# Altium schematic sheet KX1_DB_ADC_1.SchDoc
size 260 x 195 mm; PageSetup: Record=PageOptions|CenterHorizontal=True|CenterVertical=True|PrintScale=0.82|XCorrection=1.00|YCorrection=1.00|PrintKind=2|BorderSize=5000000|LeftOffset=0|BottomOffset=0|Orientation=2|PaperLength=1000|PaperWidth=1000|Scale=100|PaperSource=15|PrintQuality=600|MediaType=1|DitherType=10|PaperKind=Letter|PrintScaleMode=1
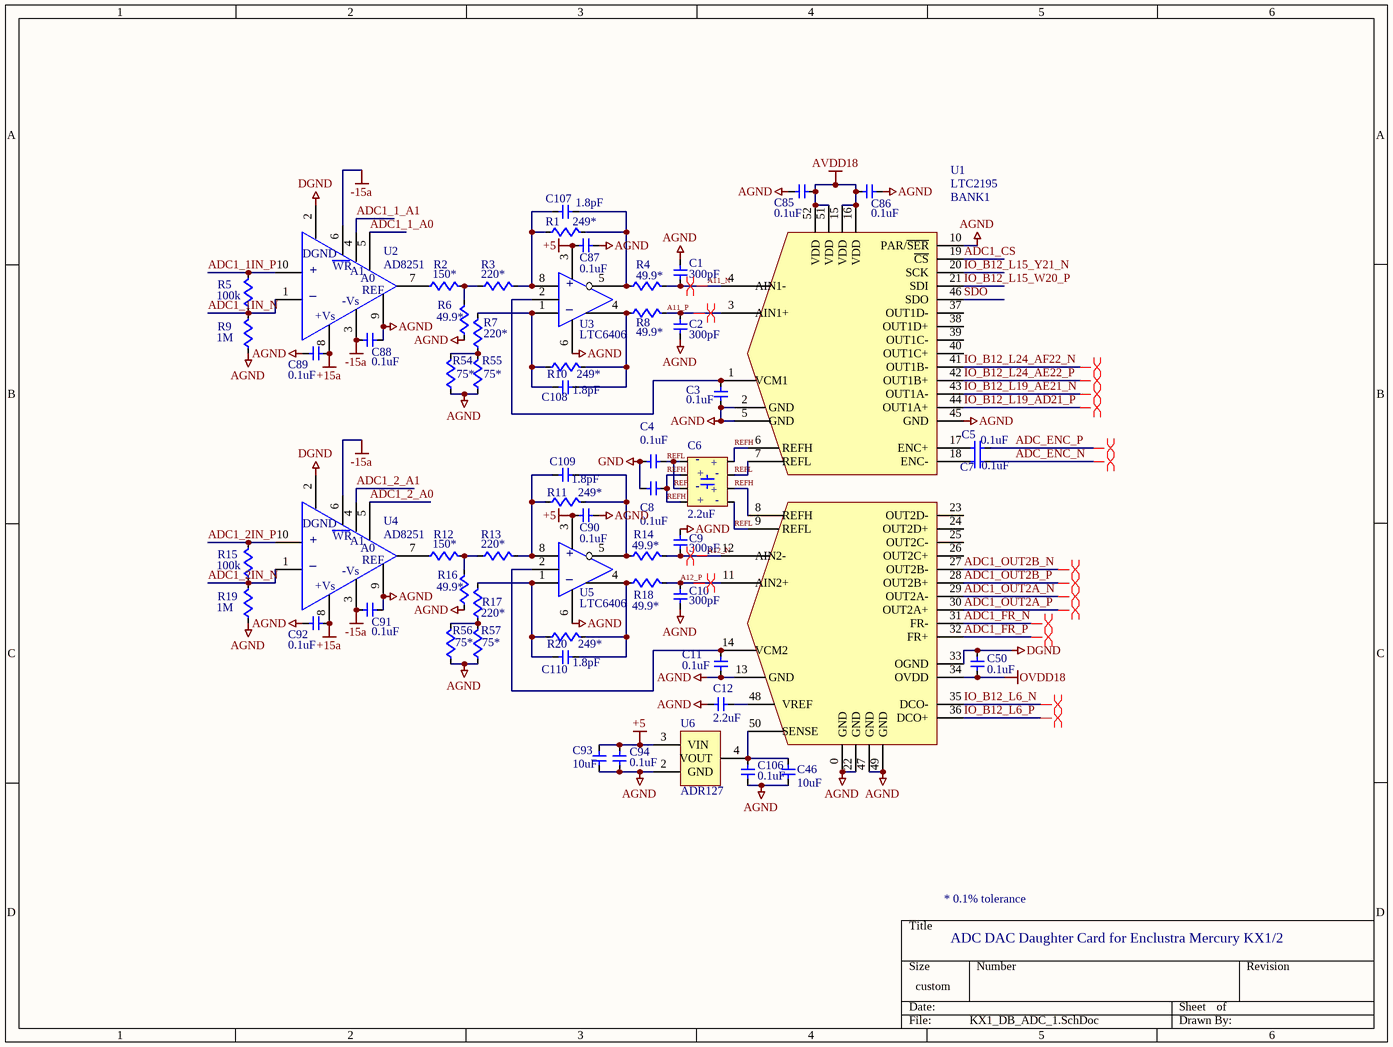
[diagram p0: KX1_DB_ADC_1.SchDoc]

## Parts
C1  300pF  [0603w]
C2  300pF  [0603w]
C3  0.1uF  [0603w]
C4  0.1uF  [0603w]
C5  0.1uF  [1206]
C6  2.2uF  [1206CLL]
C7  0.1uF  [1206]
C8  0.1uF  [0603w]
C9  300pF  [0603w]
C10  300pF  [0603w]
C11  0.1uF  [0603w]
C12  2.2uF  [0603w]
C46  10uF  [0603w]
C50  0.1uF  [0603w]
C85  0.1uF  [0603w]
C86  0.1uF  [0603w]
C87  0.1uF  [0603w]
C88  0.1uF  [0603w]
C89  0.1uF  [0603w]
C90  0.1uF  [0603w]
C91  0.1uF  [0603w]
C92  0.1uF  [0603w]
C93  10uF  [0603w]
C94  0.1uF  [0603w]
C106  0.1uF  [0603w]
C107  1.8pF  [0603w]
C108  1.8pF  [0603w]
C109  1.8pF  [0603w]
C110  1.8pF  [0603w]
R1  249*  [0603w]
R2  150*  [0603w]
R3  220*  [0603w]
R4  49.9*  [0603w]
R5  100k  [0603w]
R6  49.9*  [0603w]
R7  220*  [0603w]
R8  49.9*  [0603w]
R9  1M  [0603w]
R10  249*  [0603w]
R11  249*  [0603w]
R12  150*  [0603w]
R13  220*  [0603w]
R14  49.9*  [0603w]
R15  100k  [0603w]
R16  49.9*  [0603w]
R17  220*  [0603w]
R18  49.9*  [0603w]
R19  1M  [0603w]
R20  249*  [0603w]
R54  75*  [0603w]
R55  75*  [0603w]
R56  75*  [0603w]
R57  75*  [0603w]
U1  LTC2195  [UKG - QFN52]
U2  AD8251  [MSOP10sm]
U3  LTC6406  [MSOP08]
U4  AD8251  [MSOP10sm]
U5  LTC6406  [MSOP08]
U6  ADR127  [TSOT-6]

## Nets
+5: C87.1 C90.1 C93.1 C94.2 U3.3 U5.3 U6.3(VIN)
+15a: C89.1 C92.1 U2.8 U4.8
-15a: C88.1 C91.1 U2.3 U2.6 U4.3 U4.6
AGND: C1.1 C2.2 C3.2 C9.1 C10.2 C11.2 C12.2 C46.2 C85.2 C86.2 C87.2 C88.2 C89.2 C90.2 C91.2 C92.2 C93.2 C94.1 C106.1 R6.1 R9.1 R16.1 R19.1 R54.1 R55.1 R56.1 R57.1 U1.0(GND) U1.2(GND) U1.5(GND) U1.10(PAR/~{SER}) U1.13(GND) U1.22(GND) U1.45(GND) U1.47(GND) U1.49(GND) U2.9 U3.6 U4.9 U5.6 U6.2(GND)
AVDD18: C85.1 C86.1 U1.15(VDD) U1.16(VDD) U1.51(VDD) U1.52(VDD)
DGND: C50.1 U1.33(OGND) U2.2 U4.2
GND: C4.2 C8.2
OVDD18: C50.2 U1.34(OVDD)
A11_N: C1.2 R4.2 U1.4(AIN1-)
A11_P: C2.1 R8.2 U1.3(AIN1+)
A12_N: C9.2 R14.2 U1.12(AIN2-)
A12_P: C10.1 R18.2 U1.11(AIN2+)
ADC1_1_A0: U2.5
ADC1_1_A1: U2.4
ADC1_1IN_N: R5.1 R9.2 U2.1
ADC1_1IN_P: R5.2 U2.10
ADC1_2_A0: U4.5
ADC1_2_A1: U4.4
ADC1_2IN_N: R15.1 R19.2 U4.1
ADC1_2IN_P: R15.2 U4.10
ADC1_CS: U1.19(~{CS})
ADC1_FR_N: U1.31(FR-)
ADC1_FR_P: U1.32(FR+)
ADC1_OUT2A_N: U1.29(OUT2A-)
ADC1_OUT2A_P: U1.30(OUT2A+)
ADC1_OUT2B_N: U1.27(OUT2B-)
ADC1_OUT2B_P: U1.28(OUT2B+)
ADC_ENC_N: C7.2
ADC_ENC_P: C5.2
IO_B12_L6_N: U1.35(DCO-)
IO_B12_L6_P: U1.36(DCO+)
IO_B12_L15_W20_P: U1.21(SDI)
IO_B12_L15_Y21_N: U1.20(SCK)
IO_B12_L19_AD21_P: U1.44(OUT1A+)
IO_B12_L19_AE21_N: U1.43(OUT1A-)
IO_B12_L24_AE22_P: U1.42(OUT1B+)
IO_B12_L24_AF22_N: U1.41(OUT1B-)
REFH: C6.2 C6.4 C6.6 C6.8 C8.1 U1.6(REFH) U1.8(REFH)
REFL: C4.1 C6.1 C6.3 C6.5 C6.7 U1.7(REFL) U1.9(REFL)
SDO: U1.46(SDO)
NetC3_1: C3.1 U1.1(VCM1) U3.2
NetC5_1: C5.1 U1.17(ENC+)
NetC7_1: C7.1 U1.18(ENC-)
NetC11_1: C11.1 U1.14(VCM2) U5.2
NetC12_1: C12.1 U1.48(VREF)
NetC46_1: C46.1 C106.2 U1.50(SENSE) U6.4(VOUT)
NetC107_1: C107.1 R1.1 R3.2 U3.8
NetC107_2: C107.2 R1.2 R4.1 U3.5
NetC108_1: C108.1 R7.2 R10.1 U3.1
NetC108_2: C108.2 R8.1 R10.2 U3.4
NetC109_1: C109.1 R11.1 R13.2 U5.8
NetC109_2: C109.2 R11.2 R14.1 U5.5
NetC110_1: C110.1 R17.2 R20.1 U5.1
NetC110_2: C110.2 R18.1 R20.2 U5.4
NetR2_1: R2.1 U2.7
NetR2_2: R2.2 R3.1 R6.2
NetR7_1: R7.1 R54.2 R55.2
NetR12_1: R12.1 U4.7
NetR12_2: R12.2 R13.1 R16.2
NetR17_1: R17.1 R56.2 R57.2

Not connected (* = marked no-connect by the designer): U1 23(OUT2D-) 24(OUT2D+) 25(OUT2C-) 26(OUT2C+) 37(OUT1D-) 38(OUT1D+) 39(OUT1C-) 40(OUT1C+); U6 1(NC) 5(NC) 6(NC)

## Layout directives
differential pair: A11_N, A11_P, A12_N, A12_P, ADC1_FR_N, ADC1_FR_P, ADC1_OUT2A_N, ADC1_OUT2A_P, ADC1_OUT2B_N, ADC1_OUT2B_P, ADC_ENC_N, ADC_ENC_P, IO_B12_L6_N, IO_B12_L6_P, IO_B12_L19_AD21_P, IO_B12_L19_AE21_N, IO_B12_L24_AE22_P, IO_B12_L24_AF22_N

## Notes on the sheet
- (near U1) BANK1
- * 0.1% tolerance
- ADC DAC Daughter Card for Enclustra Mercury KX1/2
- (in symbol AD8139) +; _
- (in symbol AD8251) DGND; WR; +; A1; A0; _; REF; -Vs; +Vs
- (in symbol CAP_SM Interdigitated) +

## Library data of the parts
C1 C2 C9 C10 C107-C110 = CAP_SM_1: capacitor; Supplier 1: Digi-Key
  C1 C2 C9 C10: Supplier Part Number 1: 490-1438-1-ND
  C107-C110: Supplier Part Number 1: 712-1328-1-ND
C3 C4 C8 C11 C50 C85 C86 C88-C92 C94 C106 = CAP_SM_1: capacitor; Manufacturer: Kemet; Manufacturer Part Number: C0603C104K3RACTU; Capacitance: 0.1µF; Temperature Coefficient: X7R; Tolerance: ±10%; Voltage - Rated: 25V; Applications: General Purpose; Category: Capacitors; ComponentLink1Description: http://www.kemet.com/datasheets&C0603C104K3RACTU; ComponentLink1URL: http://www.kemet.com/datasheets&C0603C104K3RACTU; Features: -; Lead Spacing: -; Lead Style: -; Mounting Type: Surface Mount, MLCC; Operating Temperature: -55°C ~ 125°C; Package / Case: 0603 (1608 Metric); Packaging: Cut Tape (CT); Pricing 1: 10=0.075, 100=0.027, 250=0.01952, 500=0.0144, 1000=0.00975 (USD); Ratings: -; RoHS: RoHS Compliant; Size / Dimension: 0.063" L x 0.031" W (1.60mm x 0.80mm); Stock 1: 1185883; Supplier 1: Digi-Key; Supplier Part Number 1: 399-1281-1-ND; Thickness: 0.034" (0.87mm)
C5 C7 = CAP_SM_1: capacitor; Manufacturer: Murata Electronics North America; Manufacturer Part Number: GRM31C5C1E104JA01L; Capacitance: 0.1µF; Voltage - Rated: 25V; Tolerance: ±5%; Temperature Coefficient: C0G, NP0; Supplier 1: Digi-Key; Supplier Part Number 1: 490-1767-1-ND; RoHS: RoHS Compliant; Category: Capacitors; Stock 1: 374793; Pricing 1: 1=0.57, 10=0.48, 50=0.3436, 100=0.3007, 250=0.23628, 500=0.2148, 1000=0.17184 (USD); Mounting Type: Surface Mount, MLCC; Operating Temperature: -55°C ~ 125°C; Applications: General Purpose; Ratings: -; Package / Case: 1206 (3216 Metric); Size / Dimension: 0.126" L x 0.063" W (3.20mm x 1.60mm); Height: -; Thickness: 0.071" (1.80mm); Lead Spacing: -; Features: -; Packaging: Cut Tape (CT); Lead Style: -; ComponentLink1URL: http://search.murata.co.jp/Ceramy/image/img/PDF/ENG/GRM31C5C1E104JA01.pdf; ComponentLink1Description: http://search.murata.co.jp/Ceramy/image/img/PDF/ENG/GRM31C5C1E104JA01.pdf
C6 = CAP_SM Interdigitated: INTERDIGITATED capacitor; Manufacturer: TDK Corporation; Manufacturer Part Number: CLLE1AX7S0G225M/0.95; Capacitance: 2.2µF; Voltage - Rated: 4V; Tolerance: ±20%; Temperature Coefficient: X7S; Supplier 1: Digi-Key; Supplier Part Number 1: 445-3406-1-ND; RoHS: RoHS Compliant; Category: Capacitors; Stock 1: 11249; Pricing 1: 1=0.68, 10=0.54, 100=0.325, 250=0.24376, 500=0.208, 1000=0.1625 (USD); Mounting Type: Surface Mount, MLCC; Operating Temperature: -55°C ~ 125°C; Applications: General Purpose; Ratings: -; Package / Case: 0805 (2012 Metric); Size / Dimension: 0.079" L x 0.049" W (2.00mm x 1.25mm); Height: -; Thickness: 0.037" (0.95mm); Lead Spacing: -; Features: Low ESL (Multi-Terminal); Packaging: Cut Tape (CT); Lead Style: -; ComponentLink1URL: http://www.tdk.com/pdf/uli_A11.pdf; ComponentLink1Description: http://www.tdk.com/pdf/uli_A11.pdf
C12 = CAP_SM_1: capacitor; Manufacturer: AVX Corporation; Manufacturer Part Number: 06036C225KAT2A; Capacitance: 2.2µF; Voltage - Rated: 6.3V; Tolerance: ±10%; Temperature Coefficient: X7R; Supplier 1: Digi-Key; Supplier Part Number 1: 478-5316-1-ND; RoHS: RoHS Compliant; Category: Capacitors; Stock 1: 284343; Pricing 1: 10=0.209, 100=0.1235, 500=0.07126, 1000=0.0494 (USD); Mounting Type: Surface Mount, MLCC; Operating Temperature: -55°C ~ 125°C; Applications: General Purpose; Ratings: -; Package / Case: 0603 (1608 Metric); Size / Dimension: 0.063" L x 0.032" W (1.60mm x 0.81mm); Height: -; Thickness: 0.035" (0.90mm); Lead Spacing: -; Features: -; Packaging: Cut Tape (CT); Lead Style: -; ComponentLink1URL: http://www.avx.com/docs/Catalogs/cx7r.pdf; ComponentLink1Description: http://www.avx.com/docs/Catalogs/cx7r.pdf
C46 C93 = CAP_SM_1: capacitor; Manufacturer: Murata Electronics North America; Manufacturer Part Number: GRM188R60J106ME47D; Capacitance: 10µF; Voltage - Rated: 6.3V; Tolerance: ±20%; Temperature Coefficient: X5R; Supplier 1: Digi-Key; Supplier Part Number 1: 490-3896-1-ND; RoHS: RoHS Compliant; Category: Capacitors; Stock 1: 1274844; Pricing 1: 1=0.47, 10=0.369, 50=0.2428, 100=0.1926, 250=0.14236, 500=0.11056, 1000=0.0871 (USD); Mounting Type: Surface Mount, MLCC; Operating Temperature: -55°C ~ 85°C; Applications: General Purpose; Ratings: -; Package / Case: 0603 (1608 Metric); Size / Dimension: 0.063" L x 0.031" W (1.60mm x 0.80mm); Height: -; Thickness: 0.035" (0.90mm); Lead Spacing: -; Features: -; Packaging: Cut Tape (CT); Lead Style: -; ComponentLink1URL: http://search.murata.co.jp/Ceramy/image/img/PDF/ENG/GRM188R60J106ME47.pdf; ComponentLink1Description: http://search.murata.co.jp/Ceramy/image/img/PDF/ENG/GRM188R60J106ME47.pdf
C87 = CAP_SM_1: capacitor; Manufacturer: Kemet; Manufacturer Part Number: C0603C104K3RACTU; Capacitance: 0.1µF; Voltage - Rated: 25V; Tolerance: ±10%; Temperature Coefficient: X7R; Supplier 1: Digi-Key; Supplier Part Number 1: 399-1281-1-ND; RoHS: RoHS Compliant; Category: Capacitors; Stock 1: 1185883; Pricing 1: 10=0.075, 100=0.027, 250=0.01952, 500=0.0144, 1000=0.00975 (USD); Mounting Type: Surface Mount, MLCC; Operating Temperature: -55°C ~ 125°C; Applications: General Purpose; Ratings: -; Package / Case: 0603 (1608 Metric); Size / Dimension: 0.063" L x 0.031" W (1.60mm x 0.80mm); Height: -; Thickness: 0.034" (0.87mm); Lead Spacing: -; Features: -; Packaging: Cut Tape (CT); Lead Style: -; ComponentLink1URL: http://www.kemet.com/datasheets&C0603C104K3RACTU; ComponentLink1Description: http://www.kemet.com/datasheets&C0603C104K3RACTU
R1-R3 R7 R10-R13 R17 R20 = RES_SM: resistor; Supplier 1: Digi-Key
  R1 R10 R11 R20: Supplier Part Number 1: RNCS0603BKE249RCT-ND
  R2 R12: Supplier Part Number 1: RNCS0603BKE150RCT-ND
  R3 R7 R13 R17: Supplier Part Number 1: RG16P220BCT-ND
R4 R6 R8 R14 R16 R18 = RES_SM: resistor; Manufacturer: Stackpole Electronics Inc; Manufacturer Part Number: RNCS0603BKE49R9; Resistance (Ohms): 49.9; Power (Watts): 0.063W, 1/16W; Temperature Coefficient: ±25ppm/°C; Tolerance: ±0.1%; Supplier 1: Digi-Key; Supplier Part Number 1: RNCS0603BKE49R9CT-ND; RoHS: RoHS Compliant; Category: Resistors; Stock 1: 13782; Pricing 1: 1=0.7, 10=0.475, 50=0.2876, 100=0.2375, 250=0.18752, 500=0.16 (USD); Composition: Thin Film; Features: Anti-Corrosive, Moisture Resistant; Size / Dimension: 0.061" L x 0.031" W (1.55mm x 0.80mm); Height: 0.018" (0.45mm); Number of Terminations: 2; Packaging: Cut Tape (CT); Package / Case: 0603 (1608 Metric); ComponentLink1URL: http://www.seielect.com/Catalog/SEI-rncs.pdf; ComponentLink1Description: http://www.seielect.com/Catalog/SEI-rncs.pdf
R5 R15 = RES_SM: resistor; Manufacturer: Yageo; Manufacturer Part Number: RC0603FR-07100KL; Power (Watts): 0.1W, 1/10W; Temperature Coefficient: ±100ppm/°C; Tolerance: ±1%; Supplier 1: Digi-Key; Supplier Part Number 1: 311-100KHRCT-ND; RoHS: RoHS Compliant; Category: Resistors; Stock 1: 3397757; Pricing 1: 10=0.014, 50=0.0104, 100=0.0079, 250=0.00584, 500=0.00432, 1000=0.00288 (USD); Resistance (Ohms): 100K; Composition: Thick Film; Features: -; Size / Dimension: 0.063" L x 0.031" W (1.60mm x 0.80mm); Height: 0.018" (0.45mm); Number of Terminations: 2; Packaging: Cut Tape (CT); Package / Case: 0603 (1608 Metric); ComponentLink1URL: http://www.yageo.com/documents/recent/PYu-RC0603_51_RoHS_L_4.pdf; ComponentLink1Description: http://www.yageo.com/documents/recent/PYu-RC0603_51_RoHS_L_4.pdf
R9 R19 = RES_SM: resistor; Manufacturer: Yageo; Manufacturer Part Number: RC0603FR-071ML; Power (Watts): 0.1W, 1/10W; Temperature Coefficient: ±100ppm/°C; Tolerance: ±1%; Supplier 1: Digi-Key; Supplier Part Number 1: 311-1.00MHRCT-ND; RoHS: RoHS Compliant; Category: Resistors; Stock 1: 1849601; Pricing 1: 10=0.014, 50=0.0104, 100=0.0079, 250=0.00584, 500=0.00432, 1000=0.00288 (USD); Resistance (Ohms): 1M; Composition: Thick Film; Features: -; Size / Dimension: 0.063" L x 0.031" W (1.60mm x 0.80mm); Height: 0.018" (0.45mm); Number of Terminations: 2; Packaging: Cut Tape (CT); Package / Case: 0603 (1608 Metric); ComponentLink1URL: http://www.yageo.com/documents/recent/PYu-RC0603_51_RoHS_L_4.pdf; ComponentLink1Description: http://www.yageo.com/documents/recent/PYu-RC0603_51_RoHS_L_4.pdf
R54-R57 = RES_SM: resistor; Manufacturer: Stackpole Electronics Inc; Manufacturer Part Number: RNCS0603BKE75R0; Resistance (Ohms): 75; Power (Watts): 0.063W, 1/16W; Temperature Coefficient: ±25ppm/°C; Tolerance: ±0.1%; Supplier 1: Digi-Key; Supplier Part Number 1: RNCS0603BKE75R0CT-ND; RoHS: RoHS Compliant; Category: Resistors; Stock 1: 2583; Pricing 1: 1=0.7, 10=0.475, 50=0.2876, 100=0.2375, 250=0.18752, 500=0.16 (USD); Composition: Thin Film; Features: Anti-Corrosive, Moisture Resistant; Size / Dimension: 0.061" L x 0.031" W (1.55mm x 0.80mm); Height: 0.018" (0.45mm); Number of Terminations: 2; Packaging: Cut Tape (CT); Package / Case: 0603 (1608 Metric); ComponentLink1URL: http://www.seielect.com/Catalog/SEI-rncs.pdf; ComponentLink1Description: http://www.seielect.com/Catalog/SEI-rncs.pdf
U1 = LTC2195: 16 bit, low power, dual ADC; Supplier 1: Digi-Key; Supplier Part Number 1: LTC2195CUKG#PBF-ND
U2 = AD8251: Programmable Gain Instumentation Amp; Supplier 1: Digi-Key; Supplier Part Number 1: AD8251ARMZ-ND
U3 U5 = AD8139: Differential ADC Driver; Supplier 1: Digi-Key; Supplier Part Number 1: LTC6406CMS8E#PBF-ND
U4 = AD8251: IC AMP INST ICMOS LDRIFT 10MSOP; Supplier 1: Digi-Key; Supplier Part Number 1: AD8251ARMZ-ND
U6 = ADR12x: Voltage Reference; Manufacturer: Analog Devices Inc; Manufacturer Part Number: ADR127AUJZ-REEL7; Reference Type: Series, Precision; Voltage - Output: 1.25V; Tolerance: ±0.24%; Temperature Coefficient: 25ppm/°C; Voltage - Input: 2.7 V ~ 18 V; Number of Channels: 1; Current - Quiescent: 95µA; Current - Output: 5mA; Supplier 1: Digi-Key; Supplier Part Number 1: ADR127AUJZ-REEL7CT-ND; RoHS: RoHS Compliant; Category: Integrated Circuits (ICs); Stock 1: 17098; Pricing 1: 1=3.22, 25=2.484, 100=2.254, 250=2.024, 500=1.748 (USD); Current - Cathode: -; Operating Temperature: -40°C ~ 125°C; Mounting Type: Surface Mount; Package / Case: TSOT-23-6, TSOT-6; Supplier Device Package: TSOT-6; Packaging: Cut Tape (CT); ComponentLink1URL: http://www.analog.com/static/imported-files/Data_Sheets/ADR121_125_127.pdf; ComponentLink1Description: http://www.analog.com/static/imported-files/Data_Sheets/ADR121_125_127.pdf